# EAGLE schematic WiFi_MBUS_Reader (EAGLE 6.6.0)
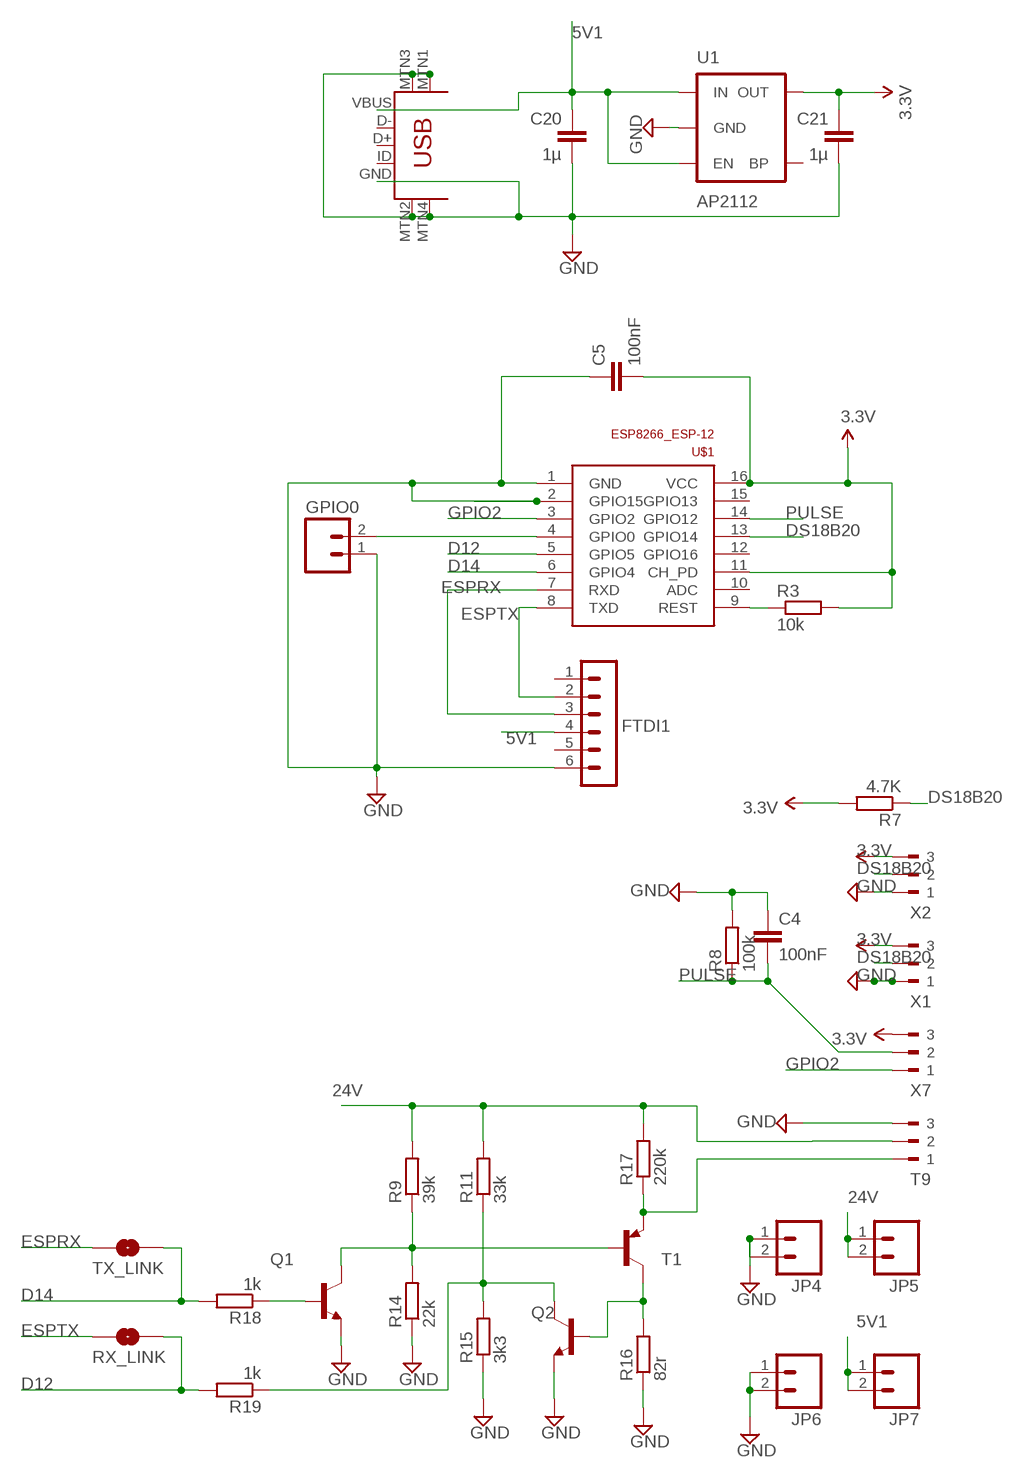
[diagram p0: schematic, sheet 1]

## Parts
C4  100nF  C-EUC0603  [C0603]
C5  100nF  C-EUC0603  [C0603]
C20  1µ  C-EUC0603  [C0603]
C21  1µ  C-EUC0603  [C0603]
FTDI1  FTDI  MA06-1  [MA06-1]
GPIO0  M02PTH  [1X02]
JP4  M02PTH  [1X02]
JP5  M02PTH  [1X02]
JP6  M02PTH  [1X02]
JP7  M02PTH  [1X02]
Q1  BC808-NPN-SOT23-BEC  [SOT23-BEC]
Q2  BC808-NPN-SOT23-BEC  [SOT23-BEC]
R3  10k  R-EU_R0603  [R0603]
R7  4.7K  R-EU_R0603  [R0603]
R8  100k  R-EU_R0603  [R0603]
R9  39k  R-EU_R0603  [R0603]
R11  33k  R-EU_R0603  [R0603]
R14  22k  R-EU_R0603  [R0603]
R15  3k3  R-EU_R0603  [R0603]
R16  82r  R-EU_R0603  [R0603]
R17  220k  R-EU_R0603  [R0603]
R18  1k  R-EU_R0603  [R0603]
R19  1k  R-EU_R0603  [R0603]
RX_LINK  SOLDERJUMPERNO  [SJ_2S-NO]
T1  BC807-16-PNP-SOT23-BEC  [SOT23-BEC]
T9  180-3  [180-3]
TX_LINK  SOLDERJUMPERNO  [SJ_2S-NO]
U1  AP2112  V_REG_LDOSMD  [SOT23-5]
U$1  ESP8266_ESP-12  [ESP8266-ESP12]
U$10  USB-MINIB-5PIN  [USB-MINIB-CISECO]
X1  180-3  [180-3]
X2  180-3  [180-3]
X7  180-3  [180-3]

## Nets
3.3V: C5.2 C21.1 R3.2 R7.2 U1.5(OUT) U$1.11(CH_PD) U$1.16(VCC) X1.3 X2.3 X7.3
5V1 [power]: C20.1 FTDI1.4 JP7.1 JP7.2 U1.1(IN) U1.3(EN) U$10.VBUS
24V: JP5.1 JP5.2 R9.2 R11.2 R17.2 T9.2
D12: R19.2 RX_LINK.2 U$1.5(GPIO5)
D14: R18.2 TX_LINK.2 U$1.6(GPIO4)
DS18B20: R7.1 U$1.13(GPIO14) X1.2 X2.2
ESPRX: FTDI1.3 TX_LINK.1 U$1.7(RXD)
ESPTX: FTDI1.2 RX_LINK.1 U$1.8(TXD)
GND [power]: C4.1 C5.1 C20.2 C21.2 FTDI1.6 GPIO0.1 JP4.1 JP4.2 JP6.1 JP6.2 Q1.E Q2.E R8.2 R14.1 R15.1 R16.1 T9.3 U1.2(GND) U$1.1(GND) U$1.2(GPIO15) U$10.GND U$10.MTN1(MTN2) U$10.MTN2(MTN3) U$10.MTN3(MTN1) U$10.MTN4 X1.1 X2.1
GPIO2: U$1.3(GPIO2) X7.1
N$13: R17.1 T1.E T9.1
N$16: Q2.B R16.2 T1.C
N$18: Q1.C R9.1 R14.2 T1.B
N$21: Q2.C R11.1 R15.2 R19.1
N$25: Q1.B R18.1
N$29: GPIO0.2 U$1.4(GPIO0)
N$40: R3.1 U$1.9(REST)
PULSE: C4.2 R8.1 U$1.14(GPIO12) X7.2
Unconnected: FTDI1.1 FTDI1.5 U1.4(BP) U$1.10(ADC) U$1.12(GPIO16) U$1.15(GPIO13) U$10.D+ U$10.D- U$10.ID

## Library data of the parts
C4 C5 C20 C21 = resistor:C-EU: CAPACITOR, European symbol
FTDI1 = JeeLabs:MA06-1: PIN HEADER
GPIO0 JP4-JP7 = SparkFun:M02: Header 2 Standard 2-pin 0.1" header. Use with straight break away headers (SKU : PRT-00116), right angle break away headers (PRT-00553), swiss pins (PRT-00743), machine pins (PRT-00117), and female headers (PRT-00115). Molex polarized connector foot print use with SKU : PRT-08233 with associated crimp pins and housings.
Q1 Q2 = transistor:*-NPN-: NPN Transistror BF959 corrected 2008.03.06
R3 R7-R9 R11 R14-R19 = rcl:R-EU_: RESISTOR, European symbol
RX_LINK TX_LINK = SparkFun:SOLDERJUMPER: Solder Jumper Standard SMD solder jumper. Used to automate production. Two varients : Normally Open and Normally Closed are the same, but have different paste layers. NC will have a large amount of paste and should jumper during reflow.
T1 = transistor:*-PNP-: PNP Transistror
T9 X1 X2 X7 = con-weidmueller-sl35:180-3: WEIDMUELLER CLAMP CONNECTOR; OC_FARNELL: unknown; OC_NEWARK: unknown
U1 = SparkFun:V_REG_LDO: Voltage Regulator LDO Standard 150mA LDO voltage regulator in SOT-23 layout. Micrel part MIC5205. BP (by-pass) pin is used to lower output noise with 470pF cap.
U$1 = ESP8266-ESP12:ESP8266_ESP-12
U$10 = Ciseco USB miniB_Updated:USB-MINIB: Mini-USB "B" connector with 5th pin broken out. Created new symbol breaking out 5th "ID" pin in mini/micro USB connector spec. See: http://en.wikipedia.org/wiki/Mini_usb#Cables. Uses same footprint as 4-pin symbol. Also added pins to connect to mounting / shield pads if required (probably not generally needed as signals aren't shielded once they leave the connector). Modified by Ciseco for Rapid Part 24-0357

## Net classes
0 default: width 0.203 mm, drill 0.6 mm, clearance 0.203 mm
1 power: width 0.381 mm, drill 0.6 mm, clearance 0.254 mm
2 gnd: width 0.254 mm, drill 0.6 mm, clearance 0.254 mm